# EAGLE design barrieren-a-1 (EAGLE 9.6.2)
AUTHOR: Balazs Racz; DRAWING_TITLE: MEB Schalterwerk Projekt; LICENSE: Licensed by the Solderpad Hardware License V2.0; REVIEWER: n/a; REVISION: A5; YEAR: 2023
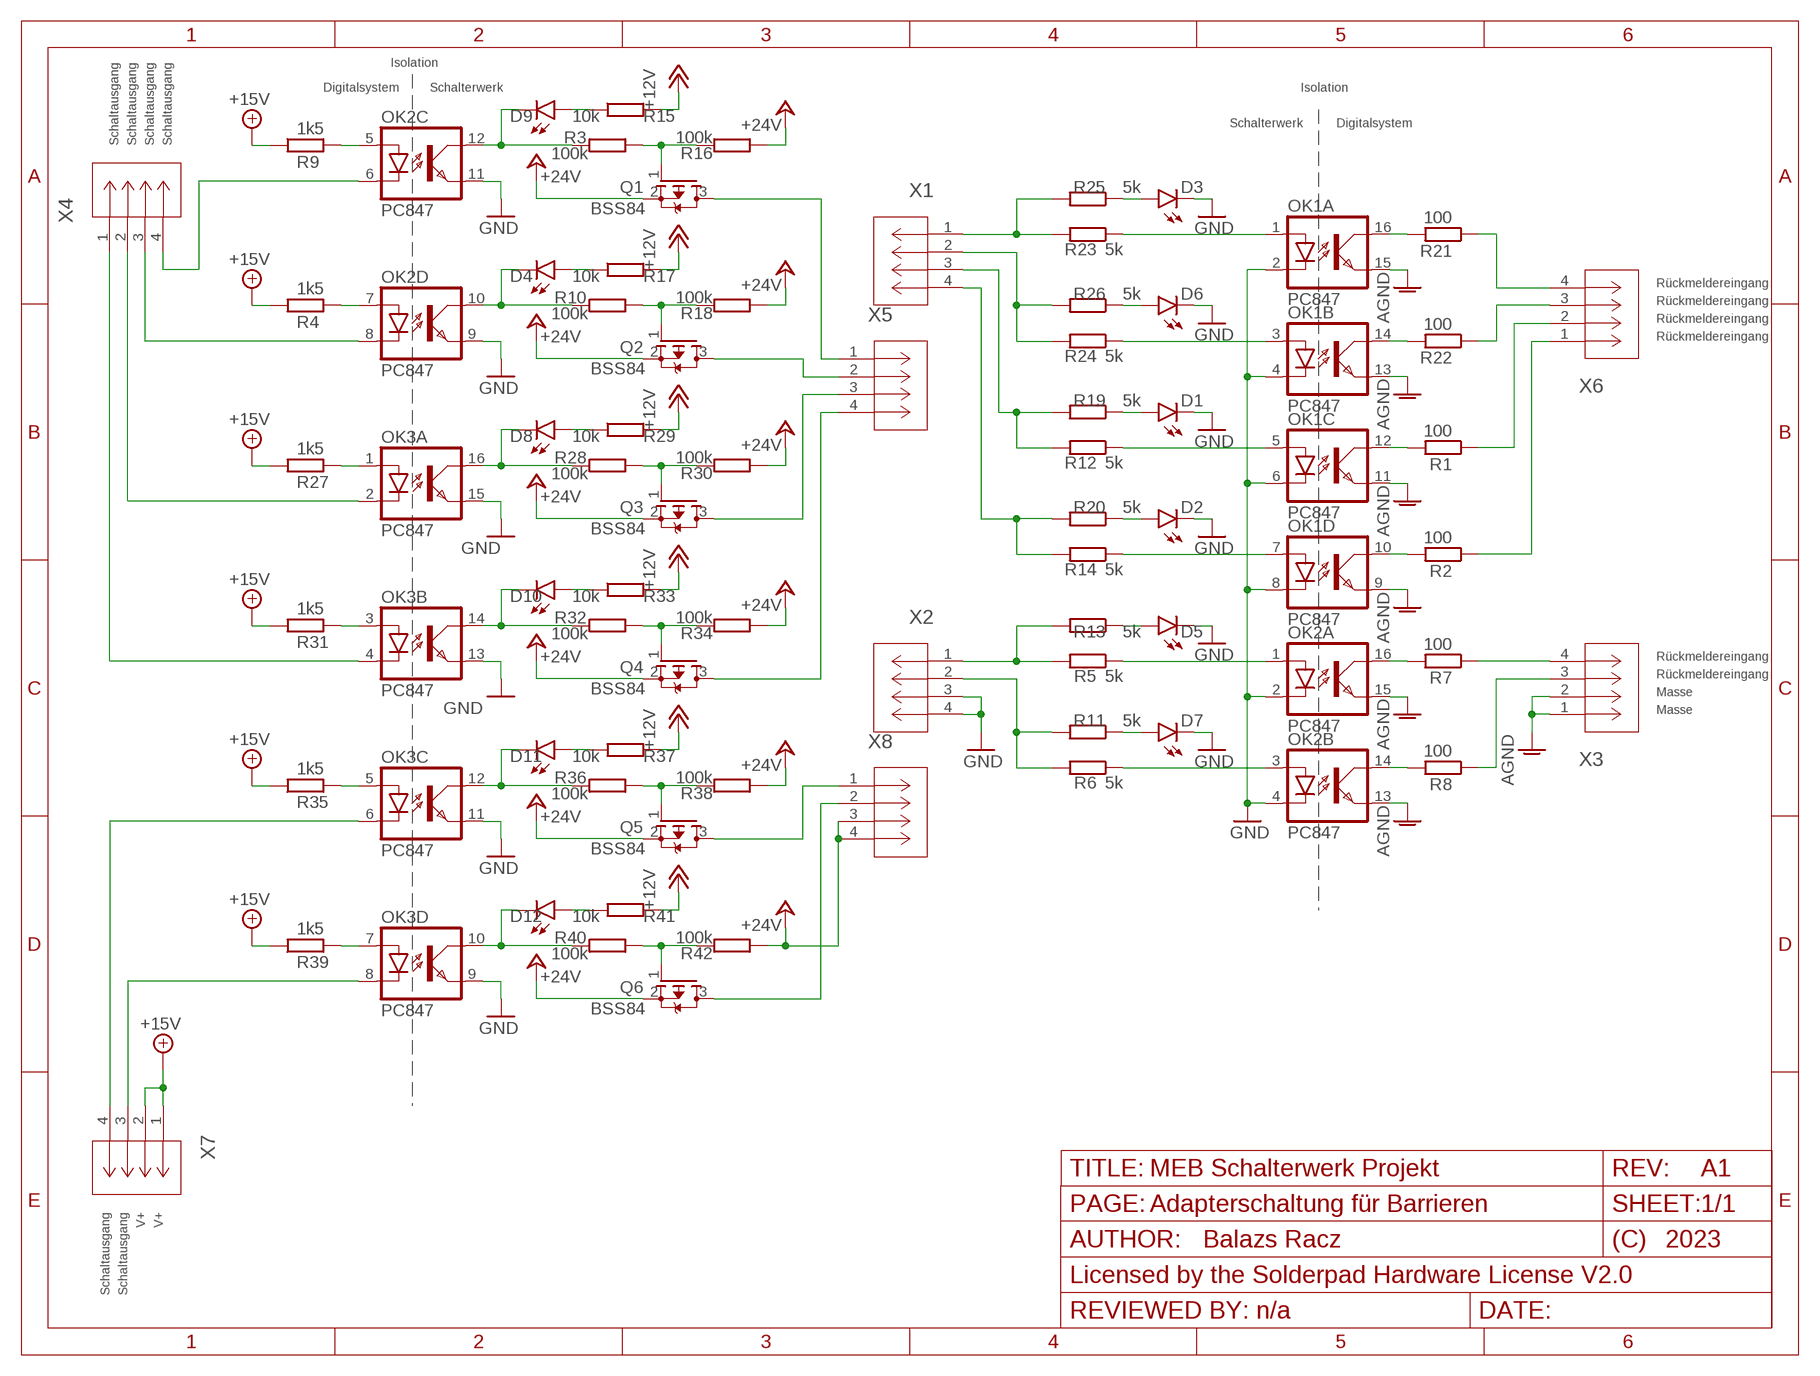
[diagram p0: schematic, sheet 1]
FRAME1 (FRAME_A_L): PAGE: Input ports
FRAME2 (FRAME_A_L): PAGE: Adapterschaltung für Barrieren; REVISION: A1

## Parts
D1  LEDCHIPLED_0603  [CHIPLED_0603]
D2  LEDCHIPLED_0603  [CHIPLED_0603]
D3  LEDCHIPLED_0603  [CHIPLED_0603]
D4  LEDCHIPLED_0603  [CHIPLED_0603]
D5  LEDCHIPLED_0603  [CHIPLED_0603]
D6  LEDCHIPLED_0603  [CHIPLED_0603]
D7  LEDCHIPLED_0603  [CHIPLED_0603]
D8  LEDCHIPLED_0603  [CHIPLED_0603]
D9  LEDCHIPLED_0603  [CHIPLED_0603]
D10  LEDCHIPLED_0603  [CHIPLED_0603]
D11  LEDCHIPLED_0603  [CHIPLED_0603]
D12  LEDCHIPLED_0603  [CHIPLED_0603]
OK1  PC847  [DIL16]
OK2  PC847  [DIL16]
OK3  PC847  [DIL16]
Q1  BSS84  [SOT23-PCH]
Q2  BSS84  [SOT23-PCH]
Q3  BSS84  [SOT23-PCH]
Q4  BSS84  [SOT23-PCH]
Q5  BSS84  [SOT23-PCH]
Q6  BSS84  [SOT23-PCH]
R1  100  R-EU_R0805  [R0805]
R2  100  R-EU_R0805  [R0805]
R3  100k  R-EU_R0805  [R0805]
R4  1k5  R-EU_R0805  [R0805]
R5  5k  R-EU_R0805  [R0805]
R6  5k  R-EU_R0805  [R0805]
R7  100  R-EU_R0805  [R0805]
R8  100  R-EU_R0805  [R0805]
R9  1k5  R-EU_R0805  [R0805]
R10  100k  R-EU_R0805  [R0805]
R11  5k  R-EU_R0805  [R0805]
R12  5k  R-EU_R0805  [R0805]
R13  5k  R-EU_R0805  [R0805]
R14  5k  R-EU_R0805  [R0805]
R15  10k  R-EU_R0805  [R0805]
R16  100k  R-EU_R0805  [R0805]
R17  10k  R-EU_R0805  [R0805]
R18  100k  R-EU_R0805  [R0805]
R19  5k  R-EU_R0805  [R0805]
R20  5k  R-EU_R0805  [R0805]
R21  100  R-EU_R0805  [R0805]
R22  100  R-EU_R0805  [R0805]
R23  5k  R-EU_R0805  [R0805]
R24  5k  R-EU_R0805  [R0805]
R25  5k  R-EU_R0805  [R0805]
R26  5k  R-EU_R0805  [R0805]
R27  1k5  R-EU_R0805  [R0805]
R28  100k  R-EU_R0805  [R0805]
R29  10k  R-EU_R0805  [R0805]
R30  100k  R-EU_R0805  [R0805]
R31  1k5  R-EU_R0805  [R0805]
R32  100k  R-EU_R0805  [R0805]
R33  10k  R-EU_R0805  [R0805]
R34  100k  R-EU_R0805  [R0805]
R35  1k5  R-EU_R0805  [R0805]
R36  100k  R-EU_R0805  [R0805]
R37  10k  R-EU_R0805  [R0805]
R38  100k  R-EU_R0805  [R0805]
R39  1k5  R-EU_R0805  [R0805]
R40  100k  R-EU_R0805  [R0805]
R41  10k  R-EU_R0805  [R0805]
R42  100k  R-EU_R0805  [R0805]
X1  PHNX_4P_350CONN_1984989_PXC  [PHNX_4P_350]
X2  PHNX_4P_350CONN_1984989_PXC  [PHNX_4P_350]
X3  PHNX_4P_350CONN_1984989_PXC  [PHNX_4P_350]
X4  PHNX_4P_350CONN_1984989_PXC  [PHNX_4P_350]
X5  PHNX_4P_350CONN_1984989_PXC  [PHNX_4P_350]
X6  PHNX_4P_350CONN_1984989_PXC  [PHNX_4P_350]
X7  PHNX_4P_350CONN_1984989_PXC  [PHNX_4P_350]
X8  PHNX_4P_350CONN_1984989_PXC  [PHNX_4P_350]

## Nets
+12V: R15.2 R17.2 R29.2 R33.2 R37.2 R41.2
+15V: R4.1 R9.1 R27.1 R31.1 R35.1 R39.1 X7.1 X7.2
+24V: Q1.2(S) Q2.2(S) Q3.2(S) Q4.2(S) Q5.2(S) Q6.2(S) R16.2 R18.2 R30.2 R34.2 R38.2 R42.2 X8.3 X8.4
AGND: OK1.9(D:EMIT) OK1.11(C:EMIT) OK1.13(B:EMIT) OK1.15(A:EMIT) OK2.13(B:EMIT) OK2.15(A:EMIT) X3.1 X3.2
GND: D1.C D2.C D3.C D5.C D6.C D7.C OK1.2(A:C) OK1.4(B:C) OK1.6(C:C) OK1.8(D:C) OK2.2(A:C) OK2.4(B:C) OK2.9(D:EMIT) OK2.11(C:EMIT) OK3.9(D:EMIT) OK3.11(C:EMIT) OK3.13(B:EMIT) OK3.15(A:EMIT) X2.3 X2.4
N$1: Q1.1(G) R3.1 R16.1
N$2: OK2.1(A:A) R5.1
N$3: D7.A R11.1
N$4: D5.A R13.1
N$5: OK2.5(C:A) R9.2
N$6: OK1.12(C:COL) R1.2
N$7: OK2.3(B:A) R6.1
N$8: OK2.7(D:A) R4.2
N$9: OK1.10(D:COL) R2.2
N$10: OK1.5(C:A) R12.1
N$11: D9.A R15.1
N$12: D4.A R17.1
N$13: D4.C OK2.10(D:COL) R10.2
N$14: Q2.1(G) R10.1 R18.1
N$15: OK3.1(A:A) R27.2
N$16: OK1.7(D:A) R14.1
N$17: D1.A R19.1
N$18: D8.A R29.1
N$19: OK2.16(A:COL) R7.2
N$20: D8.C OK3.16(A:COL) R28.2
N$21: OK2.14(B:COL) R8.2
N$22: Q3.1(G) R28.1 R30.1
N$23: OK3.3(B:A) R31.2
N$24: D2.A R20.1
N$25: R5.2 R13.2 X2.1
N$26: R12.2 R19.2 X1.3
N$27: R14.2 R20.2 X1.4
N$28: R6.2 R11.2 X2.2
N$29: D10.A R33.1
N$30: OK1.16(A:COL) R21.2
N$31: D9.C OK2.12(C:COL) R3.2
N$32: OK1.14(B:COL) R22.2
N$33: OK1.1(A:A) R23.1
N$34: D10.C OK3.14(B:COL) R32.2
N$35: OK1.3(B:A) R24.1
N$36: D3.A R25.1
N$37: D6.A R26.1
N$38: R23.2 R25.2 X1.1
N$39: R24.2 R26.2 X1.2
N$40: Q4.1(G) R32.1 R34.1
N$41: OK3.5(C:A) R35.2
N$42: D11.A R37.1
N$43: D11.C OK3.12(C:COL) R36.2
N$44: Q5.1(G) R36.1 R38.1
N$45: OK3.7(D:A) R39.2
N$46: D12.A R41.1
N$47: D12.C OK3.10(D:COL) R40.2
N$48: Q6.1(G) R40.1 R42.1
N$49: Q1.3(D) X5.1
N$50: Q2.3(D) X5.2
N$51: Q3.3(D) X5.3
N$52: Q4.3(D) X5.4
N$53: Q5.3(D) X8.1
N$54: Q6.3(D) X8.2
NX1: R1.1 X6.2
NX2: R2.1 X6.1
NX3: OK2.8(D:C) X4.3
NX4: R21.1 X6.4
NX5: R22.1 X6.3
NX6: OK3.2(A:C) X4.2
NX7: OK3.4(B:C) X4.1
NX8: OK3.6(C:C) X7.4
NX9: OK3.8(D:C) X7.3
NX41: R7.1 X3.4
NX43: R8.1 X3.3
NX45: OK2.6(C:C) X4.4

## Notes on the sheet
- Isolation
- Digitalsystem | Schalterwerk | Isolation
- Schalterwerk | Digitalsystem
- Schaltausgang | Schaltausgang | Schaltausgang | Schaltausgang
- Rückmeldereingang
- Rückmeldereingang
- Rückmeldereingang
- Rückmeldereingang
- Rückmeldereingang
- Rückmeldereingang
- Masse
- Masse
- Schaltausgang | Schaltausgang | V+ | V+

## Library data of the parts
D1-D12 = led:LED: LED OSRAM: - CHIPLED LG R971, LG N971, LY N971, LG Q971, LY Q971, LO R971, LY R971 LH N974, LH R974 LS Q976, LO Q976, LY Q976 LO Q996 - Hyper CHIPLED LW Q18S LB Q993, LB Q99A, LB R99A - SideLED LS A670, LO A670, LY A670, LG A670, LP A670 LB A673, LV A673, LT A673, LW A673 LH A674 LY A675 LS A676, LA A676, LO A676, LY A676, LW A676 LS A679, LY A679, LG A679 - Hyper Micro SIDELED® LS Y876, LA Y876, LO Y876, LY Y876 LT Y87S - SmartLED LW L88C, LW L88S LB L89C, LB L89S, LG L890 LS L89K, LO L89K, LY L89K LS L896, LA L896, LO L896, LY L896 - TOPLED LS T670, LO T670, LY T670, LG T670, LP T670 LSG T670, LSP T670, LSY T670, LOP T670, LYG T670 LG T671, LOG T671, LSG T671 LB T673, LV T673, LT T673, LW T673 LH T674 LS T676, LA T676, LO T676, LY T676, LB T676, LH T676, LSB T676, LW T676 LB T67C, LV T67C, LT T67C, LS T67K, LO T67K, LY T67K, LW E67C LS E67B, LA E67B, LO E67B, LY E67B, LB E67C, LV E67C, LT E67C LW T67C LS T679, LY T679, LG T679 LS T770, LO T770, LY T770, LG T770, LP T770 LB T773, LV T773, LT T773, LW T773 LH T774 LS E675, LA E675, LY E675, LS T675 LS T776, LA T776, LO T776, LY T776, LB T776 LHGB T686 LT T68C, LB T68C - Hyper Mini TOPLED® LB M676 - Mini TOPLED Santana® LG M470 LS M47K, LO M47K, LY M47K Source: http://www.osram.convergy.de LUXEON: - LUMILED® LXK2-PW12-R00, LXK2-PW12-S00, LXK2-PW14-U00, LXK2-PW14-V00 LXK2-PM12-R00, LXK2-PM12-S00, LXK2-PM14-U00 LXK2-PE12-Q00, LXK2-PE12-R00, LXK2-PE12-S00, LXK2-PE14-T00, LXK2-PE14-U00 LXK2-PB12-K00, LXK2-PB12-L00, LXK2-PB12-M00, LXK2-PB14-N00, LXK2-PB14-P00, LXK2-PB14-Q00 LXK2-PR12-L00, LXK2-PR12-M00, LXK2-PR14-Q00, LXK2-PR14-R00 LXK2-PD12-Q00, LXK2-PD12-R00, LXK2-PD12-S00 LXK2-PH12-R00, LXK2-PH12-S00 LXK2-PL12-P00, LXK2-PL12-Q00, LXK2-PL12-R00 Source: www.luxeon.com KINGBRIGHT: KA-3528ASYC Source: www.kingbright.com
OK1-OK3 = optocoupler:PC847: SHARP OPTO COUPLER; OC_FARNELL: 9707735; OC_NEWARK: unknown
Q1-Q6 = eagleparts:BSS84: P-CHANNEL MOS FET
R1-R42 = rcl:R-EU_: RESISTOR, European symbol; SPICEPREFIX: R
X1-X8 = eagleparts:PHNX_4P_350: https://www.digikey.com/en/products/detail/phoenix-contact/1984989/2513979 DigiKey 277-6404-ND; COPYRIGHT: Copyright (C) 2023 Ultra Librarian. All rights reserved.; MANUFACTURER_PART_NUMBER: 1984989; MFR_NAME: Phoenix Contact

## Board
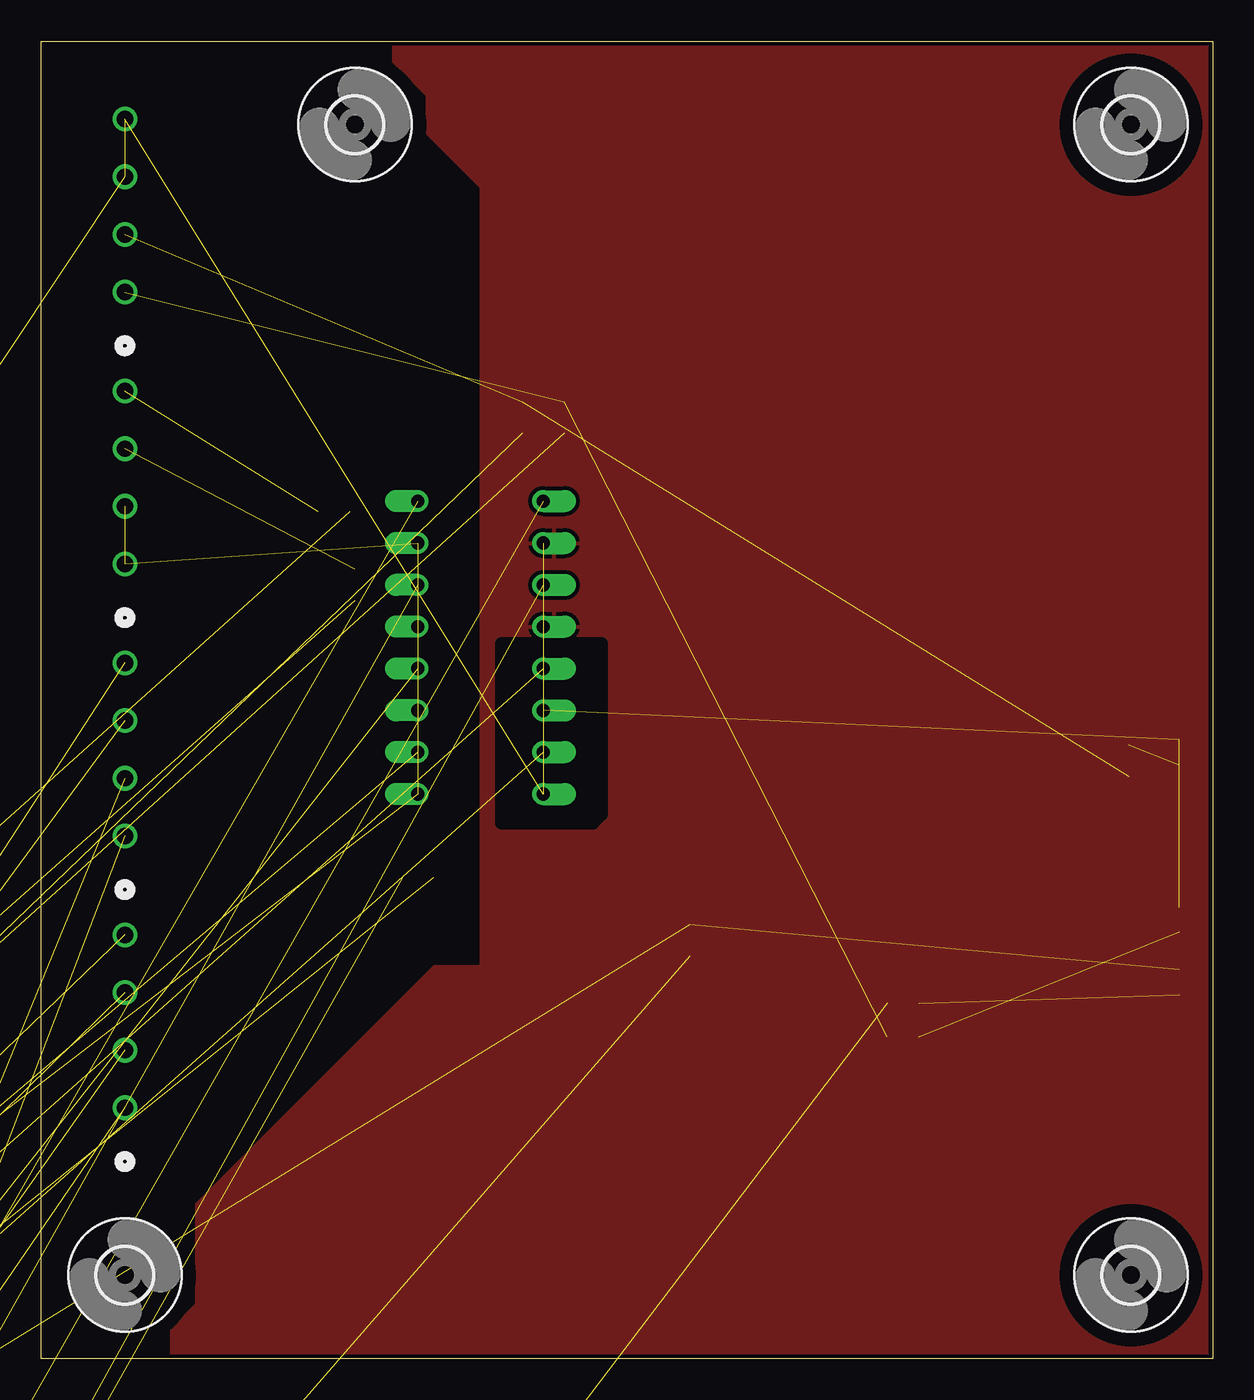
[diagram p1: board, top side]
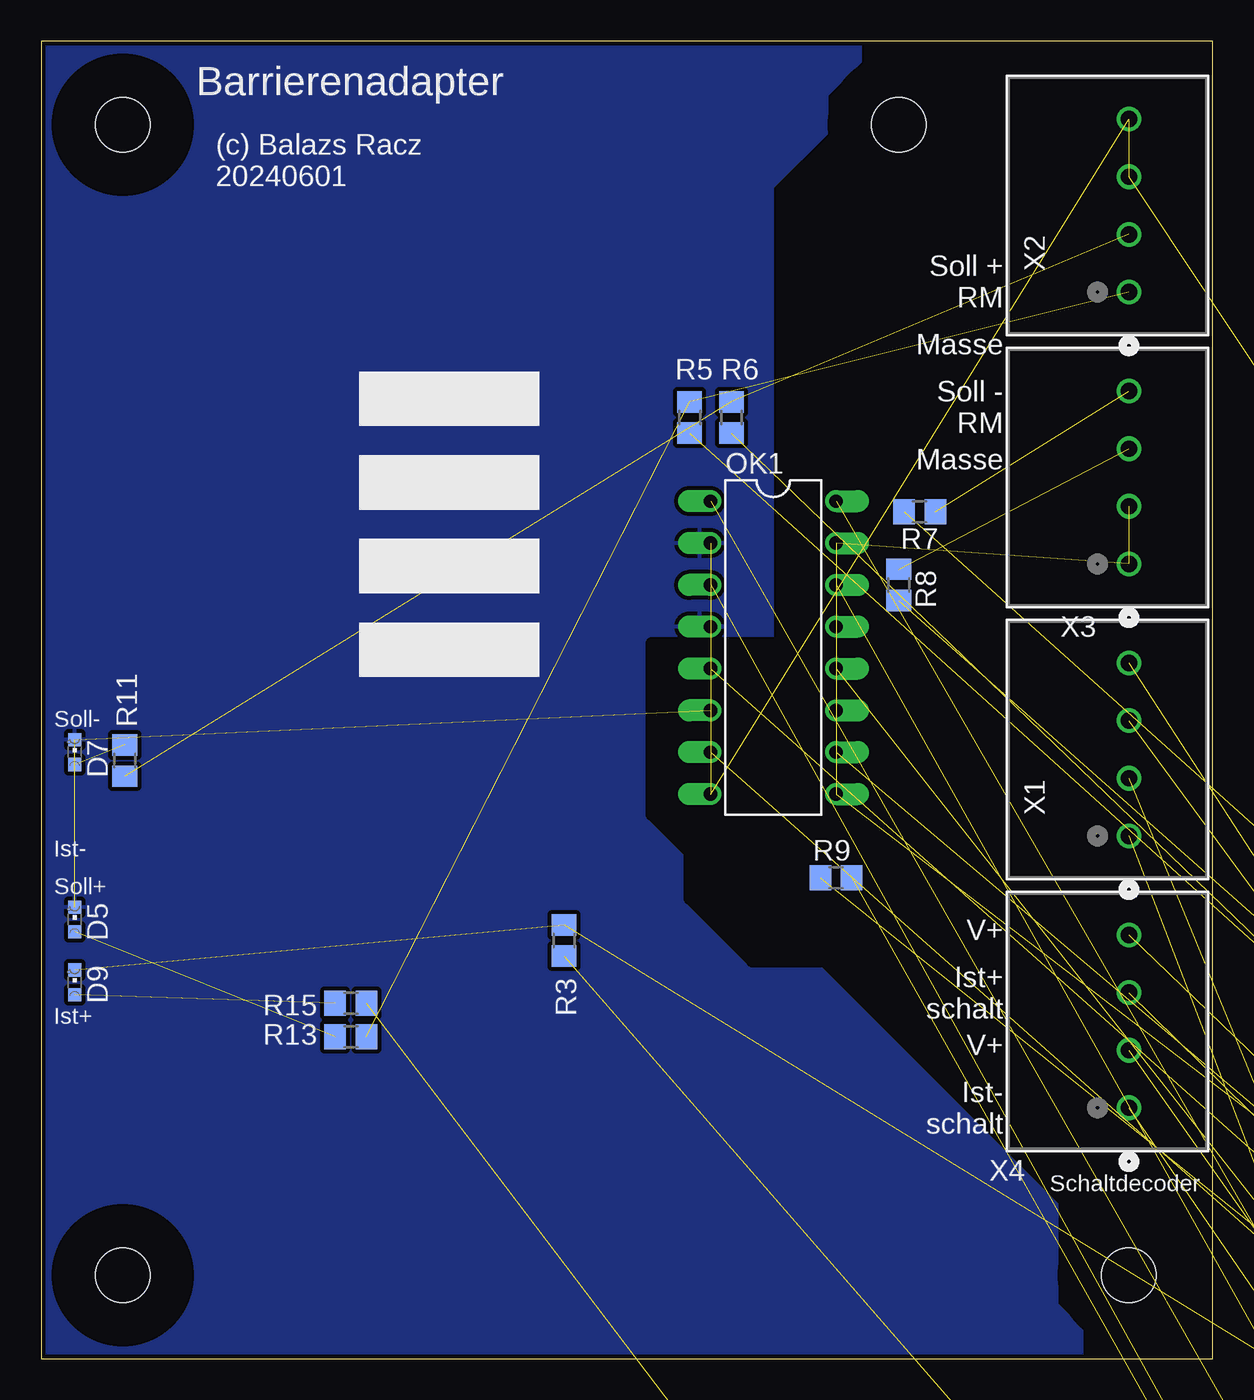
[diagram p2: board, bottom side, seen from below]

Size 71.12 x 80 mm. Coordinates in mm from the lower left corner, seen from the top.
Outline: 71.12,0 0,0 0,80 71.12,80 71.12,0
Copper layers (1*16): Top 0.035mm / dielectric 1.5mm / Bottom 0.035mm
Design rules "SeeedStudio_2layer_DRU_no_angle_20140221": minimum track width 6mil, minimum drill 12mil, track to track 6mil, track to pad 6mil, pad to pad 6mil, via to via 6mil, smd to smd 0mil, copper to edge 10mil, drill to drill 10mil, minimum pad ring 10mil, minimum via ring 6mil, stop-mask expansion 2mil, vias tented up to drill 100mil, thermal gap 10mil
tRestrict: area 27.9,32.5 to 34,43.4
bRestrict: area 19.1,24.1 to 34,43.4

### Footprints (pad centres in the part's own frame; a part is rotated, then mirrored left to right if it is on the bottom)
CHIPLED_0603 = smd 0.8 x 0.8: A 0,-0.75; C 0,0.75
3,3 = hole 3.3: 0,0
DIL16 = drill 0.813 offset: 1 -8.89,-3.81; 2 -6.35,-3.81; 3 -3.81,-3.81; 4 -1.27,-3.81; 5 1.27,-3.81; 6 3.81,-3.81; 7 6.35,-3.81; 8 8.89,-3.81; 9 8.89,3.81; 10 6.35,3.81; 11 3.81,3.81; 12 1.27,3.81; 13 -1.27,3.81; 14 -3.81,3.81; 15 -6.35,3.81; 16 -8.89,3.81
SOT23-PCH = smd 1 x 1.4: 1 -0.95,-1.1; 2 0.95,-1.1; 3 0,1.1
R0805 = smd 1.3 x 1.5: 1 -0.95,0; 2 0.95,0
PHNX_4P_350 = drill 0.991 pad 1.499: 1 0,0; 2 3.5,0; 3 7,0; 4 10.5,0

### Placement (x,y rotation side)
D1  -88.9,-59.94 0 top  (outside the outline)
D2  -85.34,-59.94 0 top  (outside the outline)
D3  -88.39,-120.14 0 top  (outside the outline)
D4  -83.57,-167.39 0 top  (outside the outline)
D5  69.09,26.67 0 bottom
D6  -84.84,-120.14 0 top  (outside the outline)
D7  69.09,36.83 0 bottom
D8  -83.06,-193.29 0 top  (outside the outline)
D9  69.09,22.86 0 bottom
D10  -83.06,-220.22 0 top  (outside the outline)
D11  -83.06,-245.87 0 top  (outside the outline)
D12  -83.06,-272.03 0 top  (outside the outline)
H1  MOUNT-HOLE3.3  [3,3]  66.17,74.93 0 top
H2  MOUNT-HOLE3.3  [3,3]  66.17,5.08 0 top
H3  MOUNT-HOLE3.3  [3,3]  5.08,5.08 0 top
H4  MOUNT-HOLE3.3  [3,3]  19.05,74.93 0 top
OK1  26.67,43.18 270 bottom
OK2  -83.82,-52.32 0 top  (outside the outline)
OK3  -83.82,-112.52 0 top  (outside the outline)
Q1  -93.73,-128.52 0 top  (outside the outline)
Q2  -93.73,-162.05 0 top  (outside the outline)
Q3  -93.73,-187.96 0 top  (outside the outline)
Q4  -93.73,-213.87 0 top  (outside the outline)
Q5  -93.73,-239.78 0 top  (outside the outline)
Q6  -93.73,-265.68 0 top  (outside the outline)
R1  -50.04,-49.53 0 top  (outside the outline)
R2  -94.23,-61.47 0 top  (outside the outline)
R3  39.37,25.4 90 bottom
R4  -88.9,-168.91 0 top  (outside the outline)
R5  31.75,57.15 90 bottom
R6  29.21,57.15 90 bottom
R7  17.78,51.44 180 bottom
R8  19.05,46.99 270 bottom
R9  22.86,29.21 180 bottom
R10  -87.38,-161.29 0 top  (outside the outline)
R11  66.04,36.32 270 bottom
R12  -71.37,-49.53 0 top  (outside the outline)
R13  52.32,19.56 0 bottom
R14  -66.04,-49.53 0 top  (outside the outline)
R15  52.32,21.59 0 bottom
R16  -94.23,-143 0 top  (outside the outline)
R17  -94.23,-168.91 0 top  (outside the outline)
R18  -81.53,-161.29 0 top  (outside the outline)
R19  -60.71,-49.53 0 top  (outside the outline)
R20  -55.37,-49.53 0 top  (outside the outline)
R21  -71.37,-109.73 0 top  (outside the outline)
R22  -66.04,-109.73 0 top  (outside the outline)
R23  -60.71,-109.73 0 top  (outside the outline)
R24  -55.37,-109.73 0 top  (outside the outline)
R25  -50.04,-109.73 0 top  (outside the outline)
R26  -94.23,-121.67 0 top  (outside the outline)
R27  -94.23,-194.82 0 top  (outside the outline)
R28  -87.38,-187.2 0 top  (outside the outline)
R29  -88.9,-194.82 0 top  (outside the outline)
R30  -81.53,-187.2 0 top  (outside the outline)
R31  -94.23,-220.73 0 top  (outside the outline)
R32  -87.38,-213.11 0 top  (outside the outline)
R33  -88.9,-220.73 0 top  (outside the outline)
R34  -81.53,-213.11 0 top  (outside the outline)
R35  -94.23,-246.63 0 top  (outside the outline)
R36  -87.38,-239.01 0 top  (outside the outline)
R37  -88.9,-246.63 0 top  (outside the outline)
R38  -81.53,-239.01 0 top  (outside the outline)
R39  -94.23,-272.54 0 top  (outside the outline)
R40  -87.38,-264.92 0 top  (outside the outline)
R41  -88.9,-272.54 0 top  (outside the outline)
R42  -81.53,-264.92 0 top  (outside the outline)
X1  5.08,31.75 90 bottom
X2  5.08,64.77 90 bottom
X3  5.08,48.26 90 bottom
X4  5.08,15.24 90 bottom
X5  -116.08,-252.73 0 top  (outside the outline)
X6  -76.71,-83.82 0 top  (outside the outline)
X7  -116.08,-294.89 0 top  (outside the outline)
X8  -155.45,-294.89 0 top  (outside the outline)

### Tracks (layer width: path | path; a pad name or v marks a point on that pad's centre or on a via)
+12V  (5 unrouted)
+15V  (7 unrouted)
+24V  (13 unrouted)
AGND  (7 unrouted)
GND  (19 unrouted)
  pour Bottom (isolate 0.254): 70.87,79.76 21.34,79.76 21.34,78.74 23.37,76.71 23.37,74.42 26.67,71.12 26.67,23.88 23.88,23.88 9.4,9.4 9.4,3.3 7.87,1.78 7.87,0.25 70.87,0.25
  pour Top (isolate 0.254): 70.87,79.76 21.34,79.76 21.34,78.74 23.37,76.71 23.37,74.42 26.67,71.12 26.67,23.88 23.88,23.88 9.4,9.4 9.4,3.3 7.87,1.78 7.87,0.25 70.87,0.25
N$1  (2 unrouted)
N$2  (1 unrouted)
N$3  (1 unrouted)
N$4  (1 unrouted)
N$5  (1 unrouted)
N$6  (1 unrouted)
N$7  (1 unrouted)
N$8  (1 unrouted)
N$9  (1 unrouted)
N$10  (1 unrouted)
N$11  (1 unrouted)
N$12  (1 unrouted)
N$13  (2 unrouted)
N$14  (2 unrouted)
N$15  (1 unrouted)
N$16  (1 unrouted)
N$17  (1 unrouted)
N$18  (1 unrouted)
N$19  (1 unrouted)
N$20  (2 unrouted)
N$21  (1 unrouted)
N$22  (2 unrouted)
N$23  (1 unrouted)
N$24  (1 unrouted)
N$25  (2 unrouted)
N$26  (2 unrouted)
N$27  (2 unrouted)
N$28  (2 unrouted)
N$29  (1 unrouted)
N$30  (1 unrouted)
N$31  (2 unrouted)
N$32  (1 unrouted)
N$33  (1 unrouted)
N$34  (2 unrouted)
N$35  (1 unrouted)
N$36  (1 unrouted)
N$37  (1 unrouted)
N$38  (2 unrouted)
N$39  (2 unrouted)
N$40  (2 unrouted)
N$41  (1 unrouted)
N$42  (1 unrouted)
N$43  (2 unrouted)
N$44  (2 unrouted)
N$45  (1 unrouted)
N$46  (1 unrouted)
N$47  (2 unrouted)
N$48  (2 unrouted)
N$49  (1 unrouted)
N$50  (1 unrouted)
N$51  (1 unrouted)
N$52  (1 unrouted)
N$53  (1 unrouted)
N$54  (1 unrouted)
NX1  (1 unrouted)
NX2  (1 unrouted)
NX3  (1 unrouted)
NX4  (1 unrouted)
NX5  (1 unrouted)
NX6  (1 unrouted)
NX7  (1 unrouted)
NX8  (1 unrouted)
NX9  (1 unrouted)
NX41  (1 unrouted)
NX43  (1 unrouted)
NX45  (1 unrouted)

### Text on the board
bNames: Barrierenadapter | (c) Balazs Racz / 20240601 | Soll + / RM | Masse | Soll - / RM | Masse | Soll- | Ist- | Soll+ | V+ | Ist+ / schalt | Ist+ | V+ | Ist- / schalt | Schaltdecoder